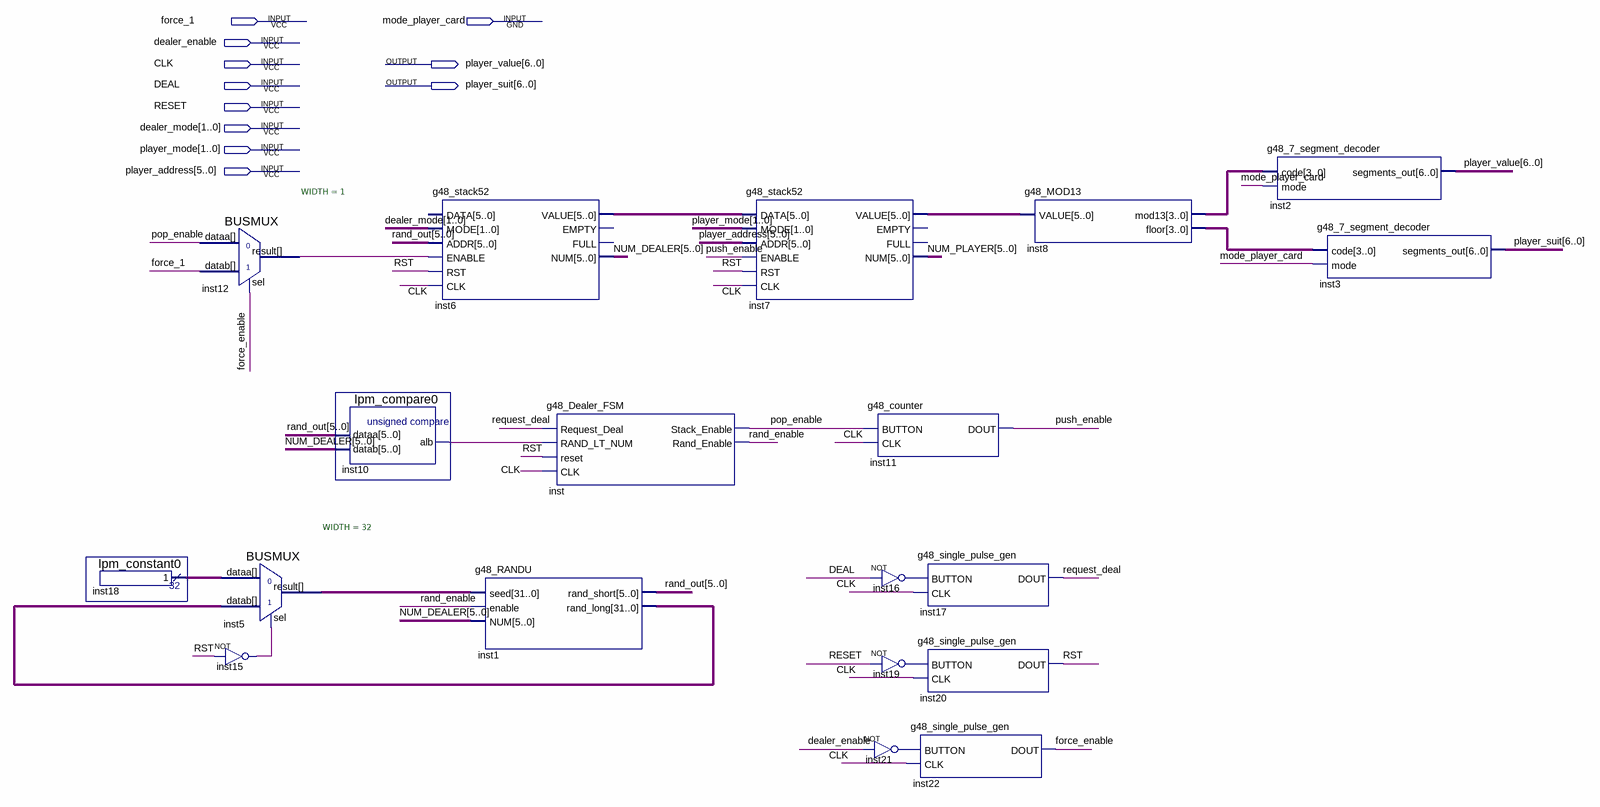
[diagram p0: schematic sheet]
// Quartus schematic g48_lab4_testbed.bdf as structural Verilog: 19 symbols, 11 pins
module g48_lab4_testbed (
  input  force_1,
  input  mode_player_card,
  input  dealer_enable,
  input  CLK,
  input  DEAL,
  input  RESET,
  input  [1:0] dealer_mode,
  input  [1:0] player_mode,
  input  [5:0] player_address,
  output [6:0] player_value,
  output [6:0] player_suit
);

  wire force_enable, inst10_alb, inst12_result, inst15_out, inst16_out, inst19_out, inst21_out, pop_enable,
       push_enable, rand_enable, request_deal, RST;
  wire [3:0] inst8_floor, inst8_mod13;
  wire [5:0] inst6_value, inst7_value, NUM_DEALER, NUM_PLAYER, rand_out;
  wire [31:0] inst1_rand_long, inst5_result, inst18_result;

  lpm_constant0 inst18 (.result(inst18_result));
  BUSMUX #(.WIDTH(1)) inst12 (.datab(force_1), .sel(force_enable), .dataa(pop_enable), .result(inst12_result));
  BUSMUX #(.WIDTH(32)) inst5 (.datab(inst1_rand_long), .sel(inst15_out), .dataa(inst18_result), .result(inst5_result));
  not inst15 (inst15_out, RST);
  lpm_compare0 inst10 (.dataa(rand_out), .datab(NUM_DEALER), .alb(inst10_alb));
  g48_stack52 inst6 (
    .MODE(dealer_mode), .ADDR(rand_out), .ENABLE(inst12_result), .RST(RST), .CLK(CLK), .VALUE(inst6_value),
    .NUM(NUM_DEALER));  // open: DATA, EMPTY, FULL
  g48_RANDU inst1 (
    .seed(inst5_result), .enable(rand_enable), .NUM(NUM_DEALER), .rand_short(rand_out),
    .rand_long(inst1_rand_long));
  g48_Dealer_FSM inst (
    .Request_Deal(request_deal), .RAND_LT_NUM(inst10_alb), .reset(RST), .CLK(CLK), .Stack_Enable(pop_enable),
    .Rand_Enable(rand_enable));
  g48_stack52 inst7 (
    .DATA(inst6_value), .MODE(player_mode), .ADDR(player_address), .ENABLE(push_enable), .RST(RST),
    .CLK(CLK), .VALUE(inst7_value), .NUM(NUM_PLAYER));  // open: EMPTY, FULL
  g48_counter inst11 (.BUTTON(pop_enable), .CLK(CLK), .DOUT(push_enable));
  not inst16 (inst16_out, DEAL);
  not inst19 (inst19_out, RESET);
  not inst21 (inst21_out, dealer_enable);
  g48_single_pulse_gen inst17 (.BUTTON(inst16_out), .CLK(CLK), .DOUT(request_deal));
  g48_single_pulse_gen inst20 (.BUTTON(inst19_out), .CLK(CLK), .DOUT(RST));
  g48_single_pulse_gen inst22 (.BUTTON(inst21_out), .CLK(CLK), .DOUT(force_enable));
  g48_MOD13 inst8 (.VALUE(inst7_value), .mod13(inst8_mod13), .floor(inst8_floor));
  g48_7_segment_decoder inst2 (.code(inst8_mod13), .mode(mode_player_card), .segments_out(player_value));
  g48_7_segment_decoder inst3 (.code(inst8_floor), .mode(mode_player_card), .segments_out(player_suit));
endmodule
